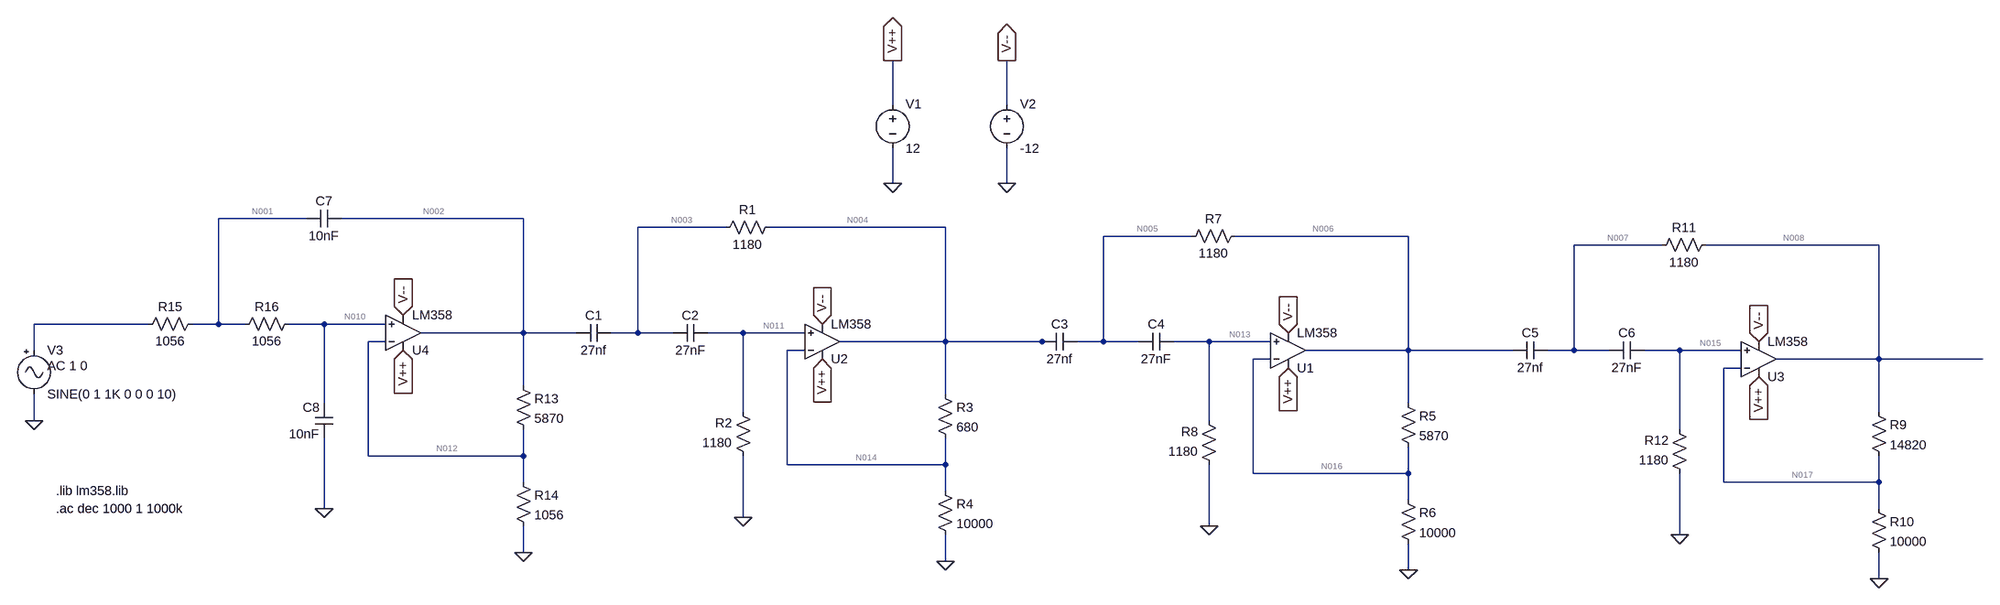
[diagram p0: schematic EEE3090F_2023_bandPassFilter_GNGJOA003.asc]
EEE3090F_2023_bandPassFilter_GNGJOA003.asc, the LTspice schematic file:
Version 4
SHEET 1 5760 680
WIRE 1072 -608 1072 -688
WIRE 1280 -608 1280 -688
WIRE 1072 -464 1072 -528
WIRE 1280 -464 1280 -528
WIRE 0 -400 -160 -400
WIRE 400 -400 64 -400
WIRE 768 -384 608 -384
WIRE 1168 -384 848 -384
WIRE 1616 -368 1456 -368
WIRE 2016 -368 1696 -368
WIRE 2496 -352 2336 -352
WIRE 2896 -352 2576 -352
WIRE -288 -208 -496 -208
WIRE -160 -208 -160 -400
WIRE -160 -208 -208 -208
WIRE -112 -208 -160 -208
WIRE 32 -208 -32 -208
WIRE 144 -208 32 -208
WIRE 400 -192 400 -400
WIRE 400 -192 208 -192
WIRE 496 -192 400 -192
WIRE 608 -192 608 -384
WIRE 608 -192 560 -192
WIRE 672 -192 608 -192
WIRE 800 -192 736 -192
WIRE 912 -192 800 -192
WIRE 144 -176 112 -176
WIRE 1168 -176 1168 -384
WIRE 1168 -176 976 -176
WIRE 1344 -176 1168 -176
WIRE 1360 -176 1344 -176
WIRE 1456 -176 1456 -368
WIRE 1456 -176 1408 -176
WIRE 1520 -176 1456 -176
WIRE 1648 -176 1584 -176
WIRE 1760 -176 1648 -176
WIRE -496 -160 -496 -208
WIRE 912 -160 880 -160
WIRE 2016 -160 2016 -368
WIRE 2016 -160 1824 -160
WIRE 2224 -160 2016 -160
WIRE 2336 -160 2336 -352
WIRE 2336 -160 2288 -160
WIRE 2400 -160 2336 -160
WIRE 2528 -160 2464 -160
WIRE 2640 -160 2528 -160
WIRE 1760 -144 1728 -144
WIRE 2896 -144 2896 -352
WIRE 2896 -144 2704 -144
WIRE 3088 -144 2896 -144
WIRE 2640 -128 2608 -128
WIRE 400 -96 400 -192
WIRE 1168 -80 1168 -176
WIRE 32 -64 32 -208
WIRE 2016 -64 2016 -160
WIRE 800 -48 800 -192
WIRE 2896 -48 2896 -144
WIRE -496 -32 -496 -80
WIRE 1648 -32 1648 -176
WIRE 2528 -16 2528 -160
WIRE 112 32 112 -176
WIRE 400 32 400 -16
WIRE 400 32 112 32
WIRE 880 48 880 -160
WIRE 1168 48 1168 0
WIRE 1168 48 880 48
WIRE 1728 64 1728 -144
WIRE 2016 64 2016 16
WIRE 2016 64 1728 64
WIRE 400 80 400 32
WIRE 2608 80 2608 -128
WIRE 2896 80 2896 32
WIRE 2896 80 2608 80
WIRE 1168 96 1168 48
WIRE 2016 112 2016 64
WIRE 32 128 32 0
WIRE 2896 128 2896 80
WIRE 800 144 800 32
WIRE 1648 160 1648 48
WIRE 2528 176 2528 64
WIRE 400 208 400 160
WIRE 1168 224 1168 176
WIRE 2016 240 2016 192
WIRE 2896 256 2896 208
FLAG 800 144 0
FLAG 1168 224 0
FLAG 944 -208 V--
IOPIN 944 -208 In
FLAG 944 -144 V++
IOPIN 944 -144 In
FLAG 1072 -464 0
FLAG 1280 -464 0
FLAG -496 -32 0
FLAG 1072 -688 V++
IOPIN 1072 -688 Out
FLAG 1280 -688 V--
IOPIN 1280 -688 Out
FLAG 1648 160 0
FLAG 2016 240 0
FLAG 1792 -192 V--
IOPIN 1792 -192 In
FLAG 1792 -128 V++
IOPIN 1792 -128 In
FLAG 2528 176 0
FLAG 2896 256 0
FLAG 2672 -176 V--
IOPIN 2672 -176 In
FLAG 2672 -112 V++
IOPIN 2672 -112 In
FLAG 32 128 0
FLAG 400 208 0
FLAG 176 -224 V--
IOPIN 176 -224 In
FLAG 176 -160 V++
IOPIN 176 -160 In
SYMBOL OpAmps\\opamp2 944 -112 M180
SYMATTR InstName U2
SYMATTR Value LM358
SYMBOL res 1152 -96 R0
SYMATTR InstName R3
SYMATTR Value 680
SYMBOL res 1152 80 R0
SYMATTR InstName R4
SYMATTR Value 10000
SYMBOL voltage 1072 -624 R0
WINDOW 123 0 0 Left 0
WINDOW 39 0 0 Left 0
SYMATTR InstName V1
SYMATTR Value 12
SYMBOL voltage 1280 -624 R0
WINDOW 123 0 0 Left 0
WINDOW 39 0 0 Left 0
SYMATTR InstName V2
SYMATTR Value -12
SYMBOL Misc\\signal -496 -176 R0
WINDOW 123 24 44 Left 2
WINDOW 39 0 0 Left 0
SYMATTR Value2 AC 1 0
SYMATTR InstName V3
SYMATTR Value SINE(0 1 1K 0 0 0 10)
SYMBOL cap 560 -208 R90
WINDOW 0 0 32 VBottom 2
WINDOW 3 32 32 VTop 2
SYMATTR InstName C1
SYMATTR Value 27nf
SYMBOL cap 736 -208 R90
WINDOW 0 0 32 VBottom 2
WINDOW 3 32 32 VTop 2
SYMATTR InstName C2
SYMATTR Value 27nF
SYMBOL res 864 -400 R90
WINDOW 0 0 56 VBottom 2
WINDOW 3 32 56 VTop 2
SYMATTR InstName R1
SYMATTR Value 1180
SYMBOL res 816 48 R180
WINDOW 0 36 76 Left 2
WINDOW 3 36 40 Left 2
SYMATTR InstName R2
SYMATTR Value 1180
SYMBOL OpAmps\\opamp2 1792 -96 M180
SYMATTR InstName U1
SYMATTR Value LM358
SYMBOL res 2000 -80 R0
SYMATTR InstName R5
SYMATTR Value 5870
SYMBOL res 2000 96 R0
SYMATTR InstName R6
SYMATTR Value 10000
SYMBOL cap 1408 -192 R90
WINDOW 0 0 32 VBottom 2
WINDOW 3 32 32 VTop 2
SYMATTR InstName C3
SYMATTR Value 27nf
SYMBOL cap 1584 -192 R90
WINDOW 0 0 32 VBottom 2
WINDOW 3 32 32 VTop 2
SYMATTR InstName C4
SYMATTR Value 27nF
SYMBOL res 1712 -384 R90
WINDOW 0 0 56 VBottom 2
WINDOW 3 32 56 VTop 2
SYMATTR InstName R7
SYMATTR Value 1180
SYMBOL res 1664 64 R180
WINDOW 0 36 76 Left 2
WINDOW 3 36 40 Left 2
SYMATTR InstName R8
SYMATTR Value 1180
SYMBOL OpAmps\\opamp2 2672 -80 M180
SYMATTR InstName U3
SYMATTR Value LM358
SYMBOL res 2880 -64 R0
SYMATTR InstName R9
SYMATTR Value 14820
SYMBOL res 2880 112 R0
SYMATTR InstName R10
SYMATTR Value 10000
SYMBOL cap 2288 -176 R90
WINDOW 0 0 32 VBottom 2
WINDOW 3 32 32 VTop 2
SYMATTR InstName C5
SYMATTR Value 27nf
SYMBOL cap 2464 -176 R90
WINDOW 0 0 32 VBottom 2
WINDOW 3 32 32 VTop 2
SYMATTR InstName C6
SYMATTR Value 27nF
SYMBOL res 2592 -368 R90
WINDOW 0 0 56 VBottom 2
WINDOW 3 32 56 VTop 2
SYMATTR InstName R11
SYMATTR Value 1180
SYMBOL res 2544 80 R180
WINDOW 0 36 76 Left 2
WINDOW 3 36 40 Left 2
SYMATTR InstName R12
SYMATTR Value 1180
SYMBOL OpAmps\\opamp2 176 -128 M180
SYMATTR InstName U4
SYMATTR Value LM358
SYMBOL res 384 -112 R0
SYMATTR InstName R13
SYMATTR Value 5870
SYMBOL res 384 64 R0
SYMATTR InstName R14
SYMATTR Value 1056
SYMBOL cap 64 -416 R90
WINDOW 0 0 32 VBottom 2
WINDOW 3 32 32 VTop 2
SYMATTR InstName C7
SYMATTR Value 10nF
SYMBOL cap 48 0 R180
WINDOW 0 24 56 Left 2
WINDOW 3 24 8 Left 2
SYMATTR InstName C8
SYMATTR Value 10nF
SYMBOL res -192 -224 R90
WINDOW 0 0 56 VBottom 2
WINDOW 3 32 56 VTop 2
SYMATTR InstName R15
SYMATTR Value 1056
SYMBOL res -16 -224 R90
WINDOW 0 0 56 VBottom 2
WINDOW 3 32 56 VTop 2
SYMATTR InstName R16
SYMATTR Value 1056
TEXT -456 96 Left 2 !.lib lm358.lib
TEXT -456 128 Left 2 !.ac dec 1000 1 1000k

The netlist it stands for:
* EEE3090F_2023_bandPassFilter_GNGJOA003.asc
XU2 N011 N014 V++ V-- N004 LM358  ; pins In+ In- V+ V- OUT
R3 N004 N014 680
R4 N014 0 10000
V1 V++ 0 12
V2 V-- 0 -12
V3 N009 0 SINE(0 1 1K 0 0 0 10) AC 1 0
C1 N003 N002 27nf
C2 N011 N003 27nF
R1 N004 N003 1180
R2 0 N011 1180
XU1 N013 N016 V++ V-- N006 LM358  ; pins In+ In- V+ V- OUT
R5 N006 N016 5870
R6 N016 0 10000
C3 N005 N004 27nf
C4 N013 N005 27nF
R7 N006 N005 1180
R8 0 N013 1180
XU3 N015 N017 V++ V-- N008 LM358  ; pins In+ In- V+ V- OUT
R9 N008 N017 14820
R10 N017 0 10000
C5 N007 N006 27nf
C6 N015 N007 27nF
R11 N008 N007 1180
R12 0 N015 1180
XU4 N010 N012 V++ V-- N002 LM358  ; pins In+ In- V+ V- OUT
R13 N002 N012 5870
R14 N012 0 1056
C7 N002 N001 10nF
C8 0 N010 10nF
R15 N001 N009 1056
R16 N010 N001 1056
.lib lm358.lib
.ac dec 1000 1 1000k
.backanno
.end

* Results of the author's LTspice run, read from the files saved beside the schematic
* Operating Point, zero values left out:
*   V(n004) = 2.966 mV
*   V(v++) = 12 V
*   V(v--) = -12 V
*   V(n014) = 2.789 mV
*   V(n011) = 23.6 µV
*   V(n003) = 2.966 mV
*   V(n002) = 18.31 mV
*   V(n006) = 4.32 mV
*   V(n016) = 2.789 mV
*   V(n013) = 23.6 µV
*   V(n005) = 4.32 mV
*   V(n008) = 6.655 mV
*   V(n017) = 2.789 mV
*   V(n015) = 23.6 µV
*   V(n007) = 6.655 mV
*   V(n012) = 2.807 mV
*   V(n010) = 42.24 µV
*   V(n001) = 21.12 µV
*   I(R16) = 20 nA
*   I(R15) = 20 nA
*   I(R14) = 2.658 µA
*   I(R13) = 2.64 µA
*   I(R12) = -20 nA
*   I(R10) = 278.9 nA
*   I(R9) = 260.9 nA
*   I(R8) = -20 nA
*   I(R6) = 278.9 nA
*   I(R5) = 260.9 nA
*   I(R2) = -20 nA
*   I(R4) = 278.9 nA
*   I(R3) = 260.9 nA
*   I(V3) = 20 nA
*   I(V2) = 1.4 mA
*   I(V1) = -1.403 mA